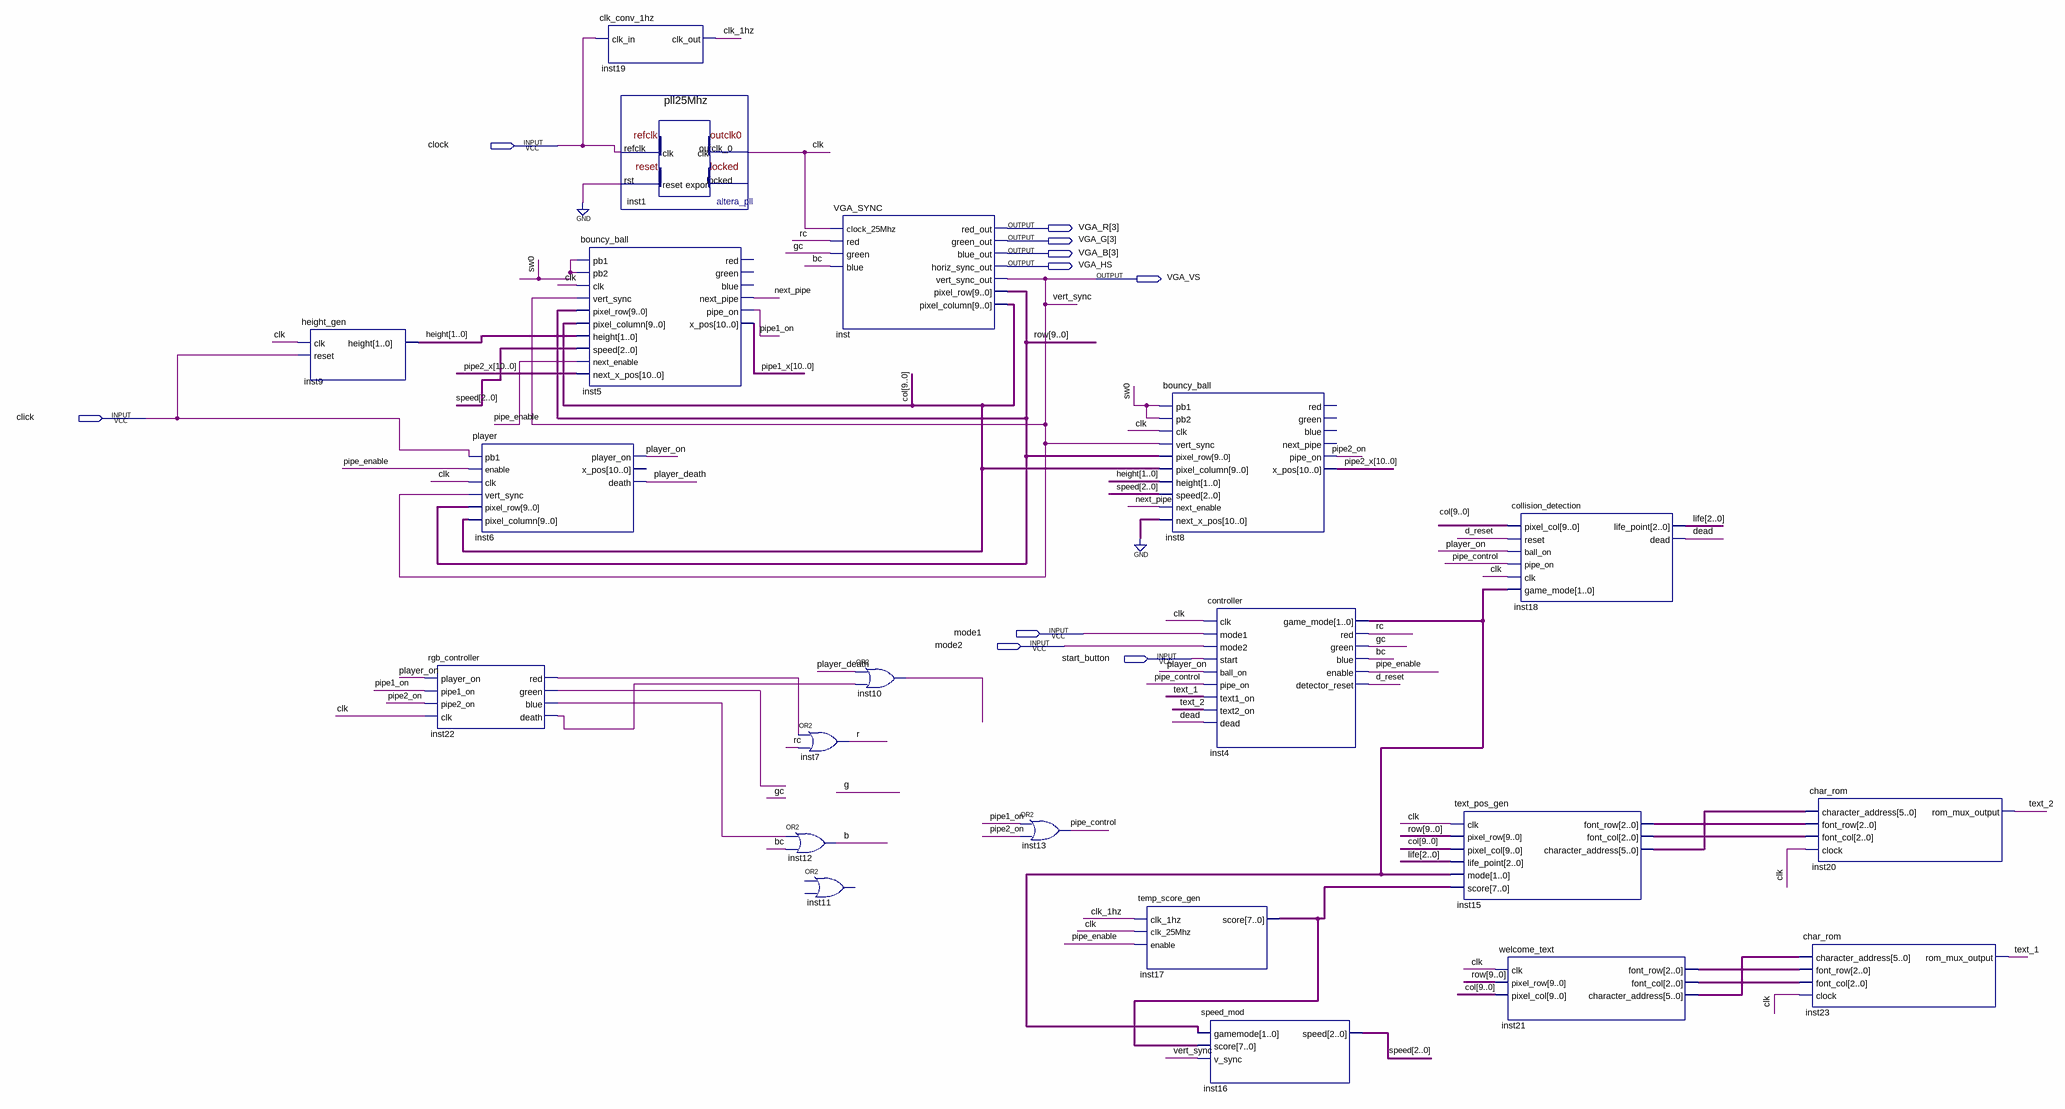
[diagram p0: schematic sheet]
// Quartus schematic pipe_tester.bdf as structural Verilog: 21 symbols, 10 pins
module pipe_tester (
  input  clock,
  input  click,
  input  mode1,
  input  mode2,
  input  start_button,
  output [3:3] VGA_R,
  output [3:3] VGA_G,
  output [3:3] VGA_B,
  output VGA_HS,
  output VGA_VS
);

  wire b, bc, clk, clk_1hz, d_reset, dead, gc, inst10_out, inst22_blue, inst22_death, inst22_green,
       inst22_red, next_pipe, pipe1_on, pipe2_on, pipe_control, pipe_enable, player_death, player_on, r, rc,
       sw0, text_1, text_2;
  wire [1:0] height, inst4_game_mode;
  wire [2:0] inst15_font_col, inst15_font_row, inst21_font_col, inst21_font_row, life, speed;
  wire [5:0] inst15_character_address, inst21_character_address;
  wire [7:0] inst17_score;
  wire [9:0] col, row;
  wire [10:0] pipe1_x, pipe2_x;

  height_gen inst9 (.clk(clk), .reset(click), .height(height));
  rgb_controller inst22 (
    .player_on(player_on), .pipe1_on(pipe1_on), .pipe2_on(pipe2_on), .clk(clk), .red(inst22_red),
    .green(inst22_green), .blue(inst22_blue), .death(inst22_death));
  player inst6 (
    .pb1(click), .enable(pipe_enable), .clk(clk), .vert_sync(VGA_VS), .pixel_row(row), .pixel_column(col),
    .player_on(player_on), .death(player_death));  // open: x_pos
  bouncy_ball inst5 (
    .pb1(sw0), .pb2(sw0), .clk(clk), .vert_sync(VGA_VS), .pixel_row(row), .pixel_column(col),
    .height(height), .speed(speed), .next_enable(pipe_enable), .next_x_pos(pipe2_x), .next_pipe(next_pipe),
    .pipe_on(pipe1_on), .x_pos(pipe1_x));  // open: red, green, blue
  clk_conv_1hz inst19 (.clk_in(clock), .clk_out(clk_1hz));
  pll25Mhz inst1 (.refclk(clock), .rst(1'b0), .outclk_0(clk));  // open: locked
  or inst12 (b, inst22_blue, bc);
  VGA_SYNC inst (
    .clock_25Mhz(clk), .red(rc), .green(gc), .blue(bc), .red_out(VGA_R[3]), .green_out(VGA_G[3]),
    .blue_out(VGA_B[3]), .horiz_sync_out(VGA_HS), .vert_sync_out(VGA_VS), .pixel_row(row), .pixel_column(col));
  or inst7 (r, inst22_red, rc);
  // OR2 inst11 is placed but not wired
  or inst10 (inst10_out, player_death, inst22_death);
  or inst13 (pipe_control, pipe1_on, pipe2_on);
  temp_score_gen inst17 (.clk_1hz(clk_1hz), .clk_25Mhz(clk), .enable(pipe_enable), .score(inst17_score));
  bouncy_ball inst8 (
    .pb1(sw0), .pb2(sw0), .clk(clk), .vert_sync(VGA_VS), .pixel_row(row), .pixel_column(col),
    .height(height), .speed(speed), .next_enable(next_pipe), .next_x_pos({11{1'b0}}), .pipe_on(pipe2_on),
    .x_pos(pipe2_x));  // open: red, green, blue, next_pipe
  speed_mod inst16 (.gamemode(inst4_game_mode), .score(inst17_score), .v_sync(VGA_VS), .speed(speed));
  controller inst4 (
    .clk(clk), .mode1(mode1), .mode2(mode2), .start(start_button), .ball_on(player_on),
    .pipe_on(pipe_control), .text1_on(text_1), .text2_on(text_2), .dead(dead), .game_mode(inst4_game_mode),
    .red(rc), .green(gc), .blue(bc), .enable(pipe_enable), .detector_reset(d_reset));
  text_pos_gen inst15 (
    .clk(clk), .pixel_row(row), .pixel_col(col), .life_point(life), .mode(inst4_game_mode),
    .score(inst17_score), .font_row(inst15_font_row), .font_col(inst15_font_col),
    .character_address(inst15_character_address));
  welcome_text inst21 (
    .clk(clk), .pixel_row(row), .pixel_col(col), .font_row(inst21_font_row), .font_col(inst21_font_col),
    .character_address(inst21_character_address));
  collision_detection inst18 (
    .pixel_col(col), .reset(d_reset), .ball_on(player_on), .pipe_on(pipe_control), .clk(clk),
    .game_mode(inst4_game_mode), .life_point(life), .dead(dead));
  char_rom inst20 (
    .character_address(inst15_character_address), .font_row(inst15_font_row), .font_col(inst15_font_col),
    .clock(clk), .rom_mux_output(text_2));
  char_rom inst23 (
    .character_address(inst21_character_address), .font_row(inst21_font_row), .font_col(inst21_font_col),
    .clock(clk), .rom_mux_output(text_1));

  // Other names for the same wires on the sheet: vert_sync = VGA_VS
endmodule
